# EAGLE design eeZeeTiny841 (EAGLE 6.4)
DATABASE: ./../../../EAGLE/PARTSDB.TXT
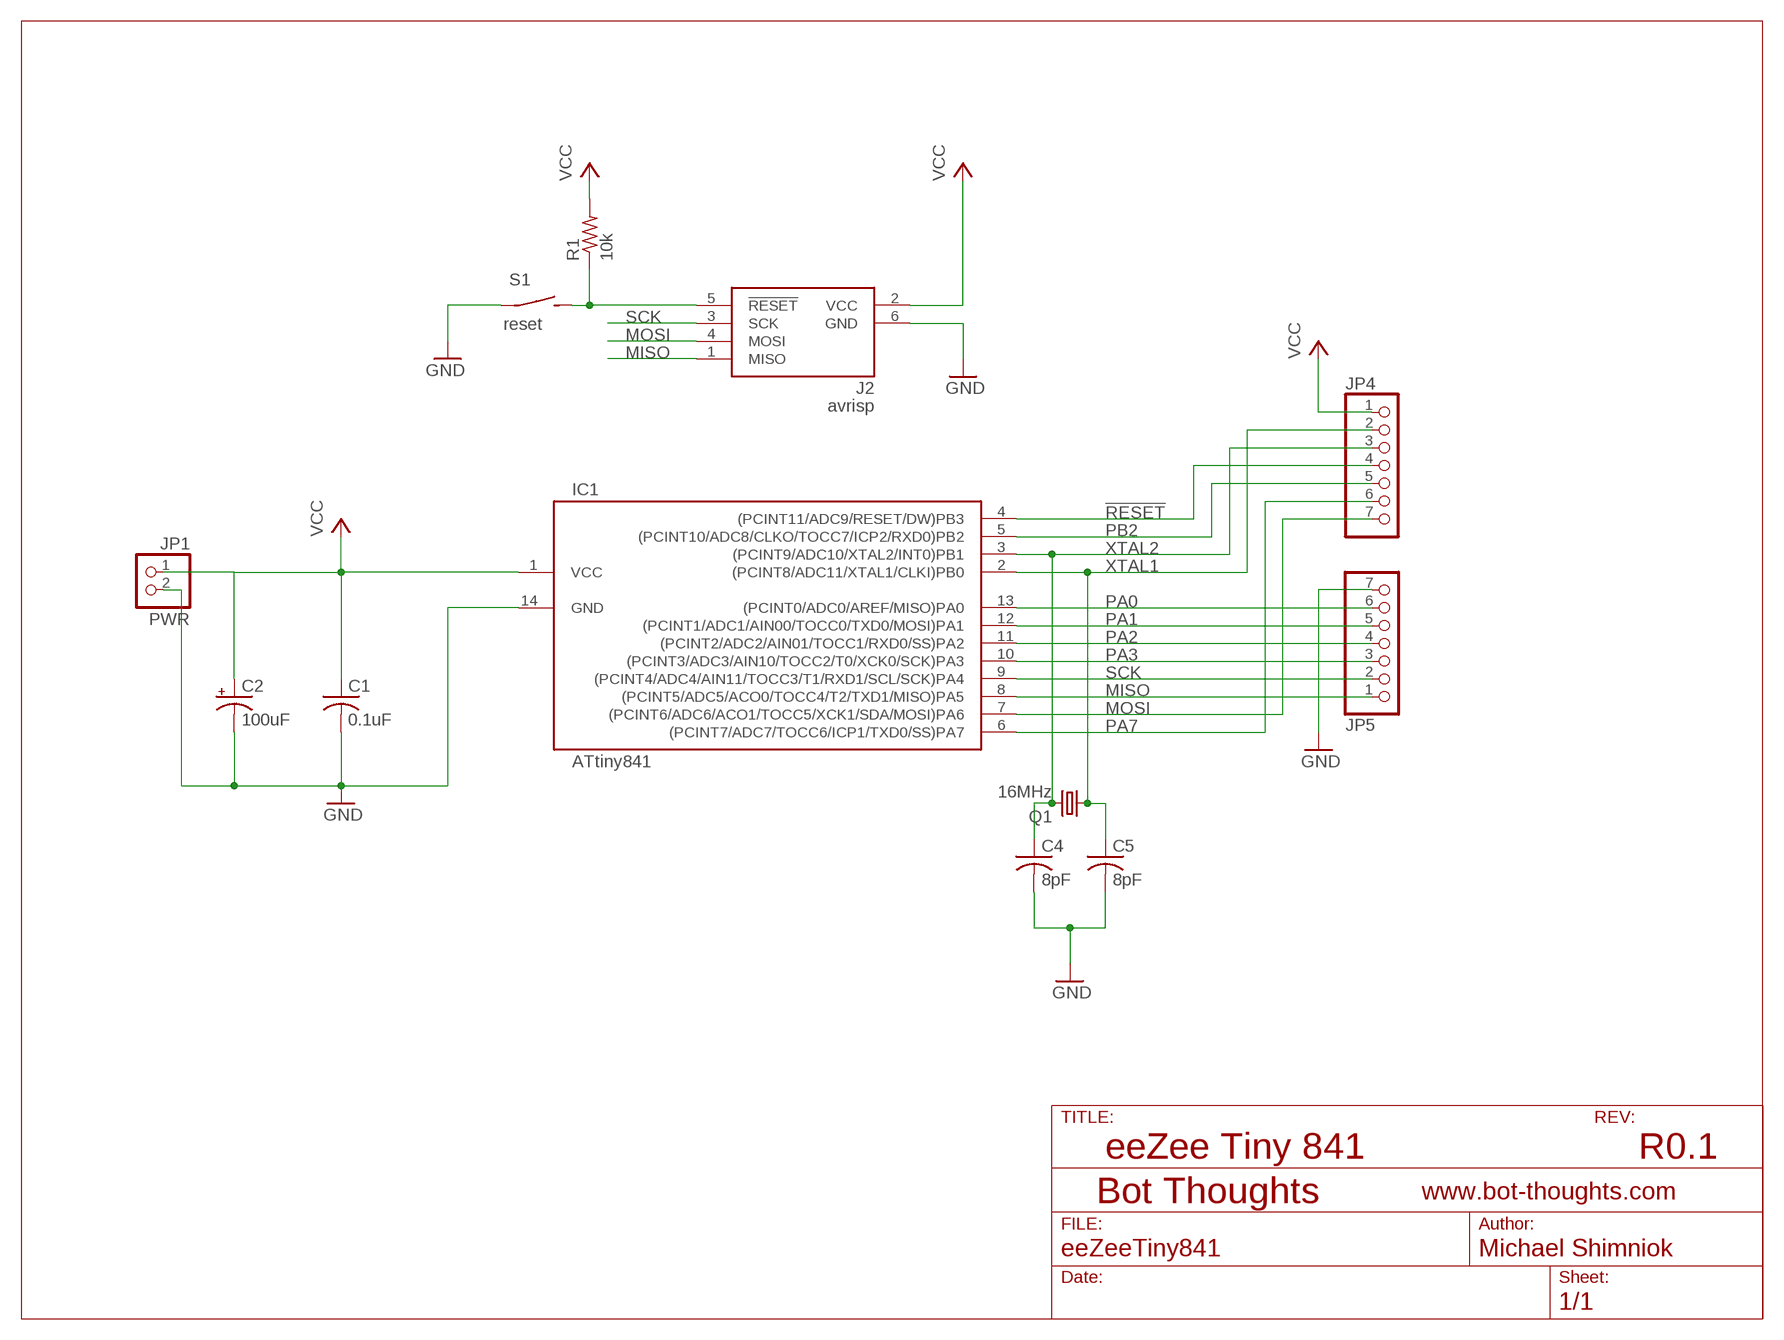
[diagram p0: schematic, sheet 1]

## Parts
C1  0.1uF  C-USC0603  [C0603]
C2  100uF  CAP_POL_SMC_B  [SMC_B]
C4  8pF  C-USC0603  [C0603]
C5  8pF  C-USC0603  [C0603]
IC1  ATtiny841  ATTINY441/841-SSU  [SOIC14]
J2  avrisp  AVRISP6  [CON6P2R]
JP1  PWR  PINHD-1X02_2.54-S  [1X02-S]
JP4  PINHD-1X07_2.54-S  [1X07-S]
JP5  PINHD-1X07_2.54-S  [1X07-S]
Q1  16MHz  CRYSTALNDK5X3  [NDK_2PAD_5X3]
R1  10k  R-US_R0603  [R0603]
S1  reset  SPST_TAC_RECT1  [6MMTACTILE_RECT]

## Nets
!RESET: IC1.4((PCINT11/ADC9/RESET/DW)PB3) J2.5(!RESET) JP4.4 R1.1 S1.P$2(S)
GND: C1.2 C2.- C4.2 C5.2 IC1.14(GND) J2.6(GND) JP1.2 JP5.7 S1.P$1(P)
MISO: IC1.11((PCINT2/ADC2/AIN01/TOCC1/RXD0/SS)PA2) J2.1(MISO) JP5.4
MOSI: IC1.12((PCINT1/ADC1/AIN00/TOCC0/TXD0/MOSI)PA1) J2.4(MOSI) JP5.5
PA0: IC1.6((PCINT7/ADC7/TOCC6/ICP1/TXD0/SS)PA7) JP4.6
PA1: IC1.7((PCINT6/ADC6/ACO1/TOCC5/XCK1/SDA/MOSI)PA6) JP4.7
PA2: IC1.8((PCINT5/ADC5/ACO0/TOCC4/T2/TXD1/MISO)PA5) JP5.1
PA3: IC1.10((PCINT3/ADC3/AIN10/TOCC2/T0/XCK0/SCK)PA3) JP5.3
PA7: IC1.13((PCINT0/ADC0/AREF/MISO)PA0) JP5.6
PB2: IC1.5((PCINT10/ADC8/CLKO/TOCC7/ICP2/RXD0)PB2) JP4.5
SCK: IC1.9((PCINT4/ADC4/AIN11/TOCC3/T1/RXD1/SCL/SCK)PA4) J2.3(SCK) JP5.2
VCC: C1.1 C2.+ IC1.1(VCC) J2.2(VCC) JP1.1 JP4.1 R1.2
XTAL1: C5.1 IC1.2((PCINT8/ADC11/XTAL1/CLKI)PB0) JP4.2 Q1.P$1
XTAL2: C4.1 IC1.3((PCINT9/ADC10/XTAL2/INT0)PB1) JP4.3 Q1.P$2

## Notes on the sheet
- eeZee Tiny 841 | R0.1

## Library data of the parts
C1 C4 C5 = rcl:C-US: CAPACITOR, American symbol; BOM: EXCLUDE; PARTNO: 0603YC104KAT2A
C2 = mes_rcl:CAP_POL: Capacitor, Polarized, American symbol; BOM: EXCLUDE; PARTNO: MCTT21X106M6R3CT
IC1 = bt_avr:ATTINY441/841: ATtiny441, ATtiny841 AVR Microcontroller The high-performance Atmel picoPower 8-bit AVR RISC-based microcontroller combines 4KB ISP flash memory, 512-Byte EEPROM, 128B SRAM, 12 general purpose I/O lines, 32 general purpose working registers, an 8-bit timer/counter with two PWM channels, two 16-bit timer/counters with two PWM channels, internal and external interrupts, an 12-channel 10-bit A/D converter, 2 On-chip analog comparators, 2 full duplex USARTs with Start Frame wake up from power down, master/slave SPI serial interface, slave I2C serial interface, programmable gain stage (1x, 20x, and 100x) for 12 differential ADC channel pairs, programmable watchdog timer with internal oscillator, internal calibrated oscillator, and four software selectable power saving modes. The device operates between 1.7-5.5 volts. datasheet.pdf <http://www.atmel.com/Images/Atmel-8495-8-bit-AVR-Microcontrollers-ATtiny441-ATtiny841_Datasheet.pdf>
J2 = bt_avr:AVRISP6: 6-pin dual-row connector for Atmel AVRISP programmer interface
JP1 = pinhead-2:PINHD-1X02: PIN HEADER
JP4 JP5 = pinhead-2:PINHD-1X07: PIN HEADER
Q1 = mes_crystal:CRYSTAL: CRYSTAL
R1 = rcl:R-US_: RESISTOR, American symbol; PARTNO: ERJ-3GEYJ103V
S1 = mes_electromech:SPST: SPST SWITCH

## Board
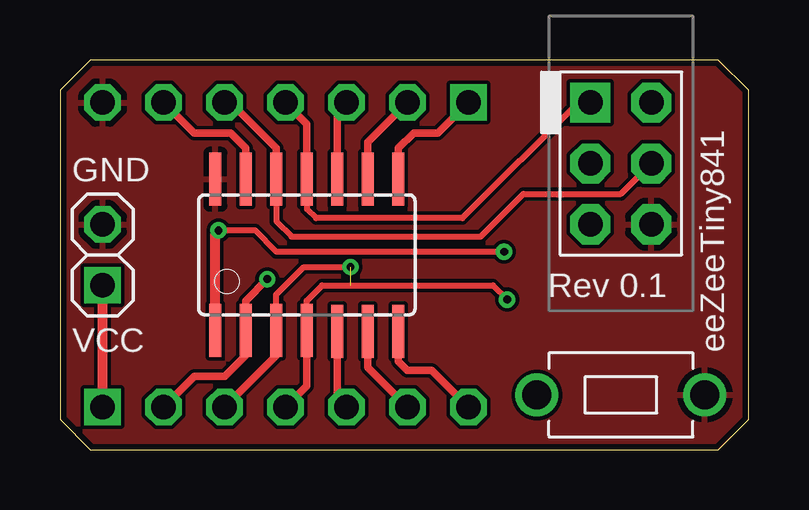
[diagram p1: board, top side]
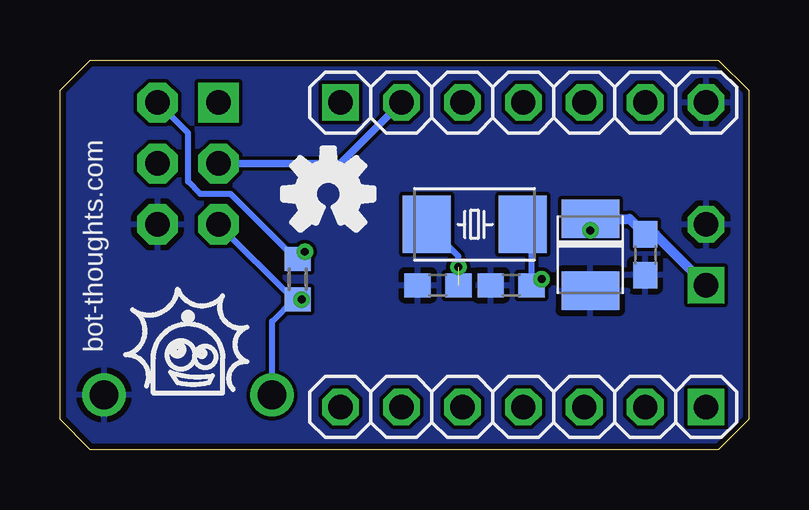
[diagram p2: board, bottom side, seen from below]

Size 28.7 x 16.26 mm. Coordinates in mm from the lower left corner, seen from the top.
Outline: 0,14.99 0,1.27 1.27,0 27.43,0 28.7,1.27 28.7,14.99 27.43,16.26 1.27,16.26 0,14.99
Copper layers (1*16): Top 0.0356mm / dielectric 1.5011mm / Bottom 0.0356mm
Design rules "default *": minimum track width 6mil, minimum drill 13mil, track to track 6mil, track to pad 6mil, pad to pad 6mil, via to via 6mil, smd to smd 6mil, copper to edge 10mil, drill to drill 6mil, minimum pad ring 7mil, minimum via ring 7mil, stop-mask expansion 4mil, vias tented up to drill 21mil, thermal gap 10mil

### Footprints (pad centres in the part's own frame; a part is rotated, then mirrored left to right if it is on the bottom)
C0603 = smd 1.1 x 1: 1 -0.85,0; 2 0.85,0
SMC_B = smd 1.6 x 2.4: + -1.5,0; - 1.5,0
SOIC14 = smd 0.5 x 2.2: 1 -1.905,-3.154; 2 -0.645,-3.154; 3 0.625,-3.154; 4 1.895,-3.154; 5 3.175,-3.196; 6 4.445,-3.196; 7 5.715,-3.196; 8 5.715,3.154; 9 4.445,3.154; 10 3.175,3.154; 11 1.905,3.154; 12 0.635,3.154; 13 -0.635,3.154; 14 -1.905,3.154
CON6P2R = drill 1.016 pad 1.676 square: 1 -2.54,-1.27 | drill 1.016 pad 1.676 octagon: 2 -2.54,1.27; 3 0,-1.27; 4 0,1.27; 5 2.54,-1.27; 6 2.54,1.27
1X02-S = drill 1.016 square: 1 -1.27,0 | drill 1.016 octagon: 2 1.27,0
1X07-S = drill 1.016 square: 1 -7.62,0 | drill 1.016 octagon: 2 -5.08,0; 3 -2.54,0; 4 0,0; 5 2.54,0; 6 5.08,0; 7 7.62,0
NDK_2PAD_5X3 = smd 2 x 2.4: P$1 -2,0; P$2 2,0
R0603 = smd 1 x 1.1: 1 -0.85,0; 2 0.85,0
6MMTACTILE_RECT = drill 1.2: P$1 -3.5,0; P$2 3.5,0

### Placement (x,y rotation side)
C1  4.32,8.13 270 bottom
C2  6.6,8.13 270 bottom
C4  12.95,6.86 180 bottom
C5  9.91,6.86 180 bottom
IC1  8.38,8.13 0 top
J2  23.37,11.94 270 top
JP1  1.78,8.13 90 top
JP4  9.4,1.78 180 bottom
JP5  9.4,14.48 0 bottom
Q1  11.43,9.4 180 bottom
R1  18.8,7.11 90 bottom
S1  23.37,2.29 180 top

### Tracks (layer width: path | path; a pad name or v marks a point on that pad's centre or on a via)
!RESET  (via drill 0.33)
  Top 0.254: IC1.4 10.28,6.21 10.92,6.86 18.03,6.86 v18.63,6.26
  Top 0.305: IC1.4 10.28,2.66 JP4.4
  Bottom 0.254: v18.63,6.26 R1.1 18.96,6.26 | J2.5 18.96,6.26 | S1.P$2 19.87,5.36 18.96,6.26
GND
  pour Bottom: 0,16.26 28.7,16.26 28.7,0 0,0
  pour Top: 0,16.26 28.7,16.26 28.7,0 0,0
MISO
  Top 0.254: J2.1 21.59,14.48 16.76,9.65 10.67,9.65 10.29,10.03 IC1.11
  Top 0.305: IC1.11 10.29,13.59 JP5.4
MOSI
  Top 0.254: J2.4 23.37,10.67 19.3,10.67 17.53,8.89 9.65,8.89 9.02,9.53 IC1.12
  Top 0.305: IC1.12 9.02,12.57 7.11,14.48 JP5.5
PA0
  Top 0.305: IC1.6 12.83,3.43 JP4.6
PA1
  Top 0.305: IC1.7 14.1,3.68 14.48,3.3 15.49,3.3 JP4.7
PA2
  Top 0.305: IC1.8 14.1,12.57 14.73,13.21 15.75,13.21 JP5.1
PA3
  Top 0.305: IC1.10 11.56,14.1 JP5.3
PA7
  Top 0.305: IC1.13 7.75,12.57 7.11,13.21 5.59,13.21 JP5.6
PB2
  Top 0.305: IC1.5 11.56,2.16 JP4.5
SCK
  Top 0.305: IC1.9 12.83,12.83 JP5.2
  Bottom 0.305: J2.3 17.02,11.94 JP5.2
VCC  (via drill 0.33)
  Top 0.254: v18.5,8.26 9.02,8.26 8.13,9.14 v6.6,9.14
  Top 0.406: IC1.1 6.48,9.02 v6.6,9.14 | JP4.1 JP1.1
  Bottom 0.254: v18.5,8.26 R1.2 18.88,7.96 21.59,10.67 22.86,10.67 23.37,11.18 23.37,13.21 J2.2
  Bottom 0.406: v6.6,9.14 C2.+ 4.97,9.63 C1.1 3.9,8.98 JP1.1
XTAL1  (via drill 0.33)
  Top 0.305: JP4.2 5.59,3.05 6.86,3.05 7.74,3.93 IC1.2 7.74,6.21 v8.64,7.11
  Bottom 0.254: C5.1 9.06,9.02 Q1.P$1
  Bottom 0.305: v8.64,7.11 C5.1
XTAL2  (via drill 0.33)  (1 unrouted)
  Top 0.254: IC1.3 9.01,6.47 10.16,7.62 v12.1,7.62
  Top 0.305: IC1.3 9.01,3.93 JP4.3
  Bottom 0.254: v12.1,7.62 12.1,8.07 Q1.P$2

### Text on the board
tNames: GND | Rev 0.1 | VCC | eeZeeTiny841
bNames: bot-thoughts.com
tsilk: TINY24/44/84 | Rev 0.2 | reset | eeZeeMedTiny
bsilk: bot-thoughts.com